# Altium schematic sheet Power.SchDoc
size A; SheetNumber: 3; SheetTotal: 4
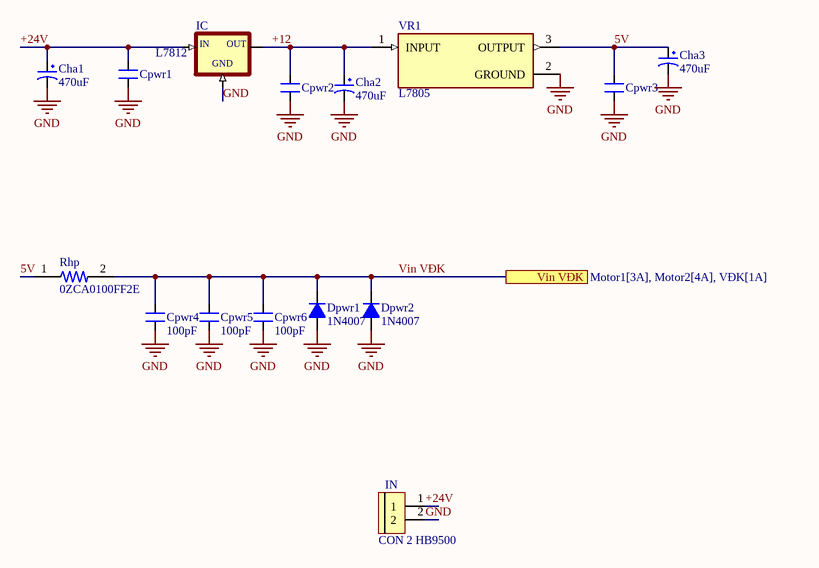
[diagram p0: Power.SchDoc]

## Parts
Cha1  470uF  [CP1.5/3.4]
Cha2  470uF  [CP1.5/3.4]
Cha3  470uF  [CP1.5/3.4]
Cpwr1  100pF  [CN1]  (value not drawn)
Cpwr2  100pF  [CN1]  (value not drawn)
Cpwr3  100pF  [CN1]  (value not drawn)
Cpwr4  100pF  [CN1]
Cpwr5  100pF  [CN1]
Cpwr6  100pF  [CN1]
Dpwr1  1N4007  [D0.5A]
Dpwr2  1N4007  [D0.5A]
IC  L7812  [78XXS]
IN  CON 2 HB9500  [CON 2 HB9500]
Rhp  0ZCA0100FF2E  [RESC3216X125N]
VR1  L7805  [TO255P1020X450X2000-3]

## Ports
Vin VĐK (see Motor1[3A], Motor2[4A], VĐK[1A])

## Nets
GND: Cha1.2 Cha2.2 Cha3.2 Cpwr1.2 Cpwr2.2 Cpwr3.2 Cpwr4.2 Cpwr5.2 Cpwr6.2 Dpwr1.1(A) Dpwr2.1(A) IC.GND IN.2 VR1.2(GROUND)
5V: Cha3.1 Cpwr3.1 Rhp.1 VR1.3(OUTPUT)
+12: Cha2.1 Cpwr2.1 IC.OUT VR1.1(INPUT)
+24V: Cha1.1 Cpwr1.1 IC.IN IN.1
Vin VĐK: Cpwr4.1 Cpwr5.1 Cpwr6.1 Dpwr1.2(K) Dpwr2.2(K) Rhp.2 ; port Vin VĐK

## Library data of the parts
Cha1-Cha3 = CP4: Cap 1000uF/16V - 220uF/50V; Description 5: 4,7uF>10uF/250V_3,3uF>10uF/400V - 2,2uF>4,7uF/450V; Description 1: 2200uF-3300uF/6,3V - 1000uF-2200uF/10V; Description 2: 1000uF/16V - 470uF => 1000uF/25V - 100uF/100V; Description 3: 330uF>470uF/35V_220uF>470uF/50V_10uF>22uF/250V; Description 4: 220uF => 330uF/63V - 10uF =>33uF/160 - 200V; Value: 1000uF/16V
Cpwr1-Cpwr6 = CN1: Cap np  1pF - 472pF; Value: 100pF
Dpwr1 Dpwr2 = D1A: Diode 1A; Value: 1N4007
IC = L7812: Linear Voltage Regulator IC 1 Output 1.5A D2PAK; MF: STMicroelectronics; Value: *; SnapEDA_Link: https://www.snapeda.com/parts/L7812/STMicroelectronics/view-part/562240/?ref=snap; Package: D2PAK STMicroelectronics; MP: L7812; Availability: Unavailable; Price: None
IN = CON 2 HB9500: Cắm; Ma_Hang: MH002054; Ten_Linh_Kien: CON 2 HB9500-2P 9.5MM; Chung_Loai: Cắm; Ghi_Chu: *; Kieu_Chan: *; Don_Vi: Con
Rhp = 0ZCA0100FF2E: Polymeric PTC Resettable Fuse 6V 1 A Ih Surface Mount 1206 (3216 Metric), Concave; MF: Bel Fuse; Check_prices: https://www.snapeda.com/parts/0ZCA0100FF2E/Bel+Fuse+Inc./view-part/?ref=eda; Value: *; Availability: In Stock; MP: 0ZCA0100FF2E; Price: None; Package: 1206 Bel Fuse; SnapEDA_Link: https://www.snapeda.com/parts/0ZCA0100FF2E/Bel+Fuse+Inc./view-part/?ref=snap; Purchase-URL: https://pricing.snapeda.com/search/part/0ZCA0100FF2E/?ref=eda
VR1 = L7805: Standard Regulator Pos 5V 1.5A 3-Pin(3+Tab) TO-220FP Tube; MF: STMicroelectronics; MP: L7805; Value: *; SnapEDA_Link: https://www.snapeda.com/parts/L7805/STMicroelectronics/view-part/?ref=snap; Price: None; Package: None; Check_prices: https://www.snapeda.com/parts/L7805/STMicroelectronics/view-part/?ref=eda; Availability: Not in stock